# Altium schematic sheet vca_B.SchDoc
size 381 x 241 mm; SheetNumber: 4; SheetTotal: 12
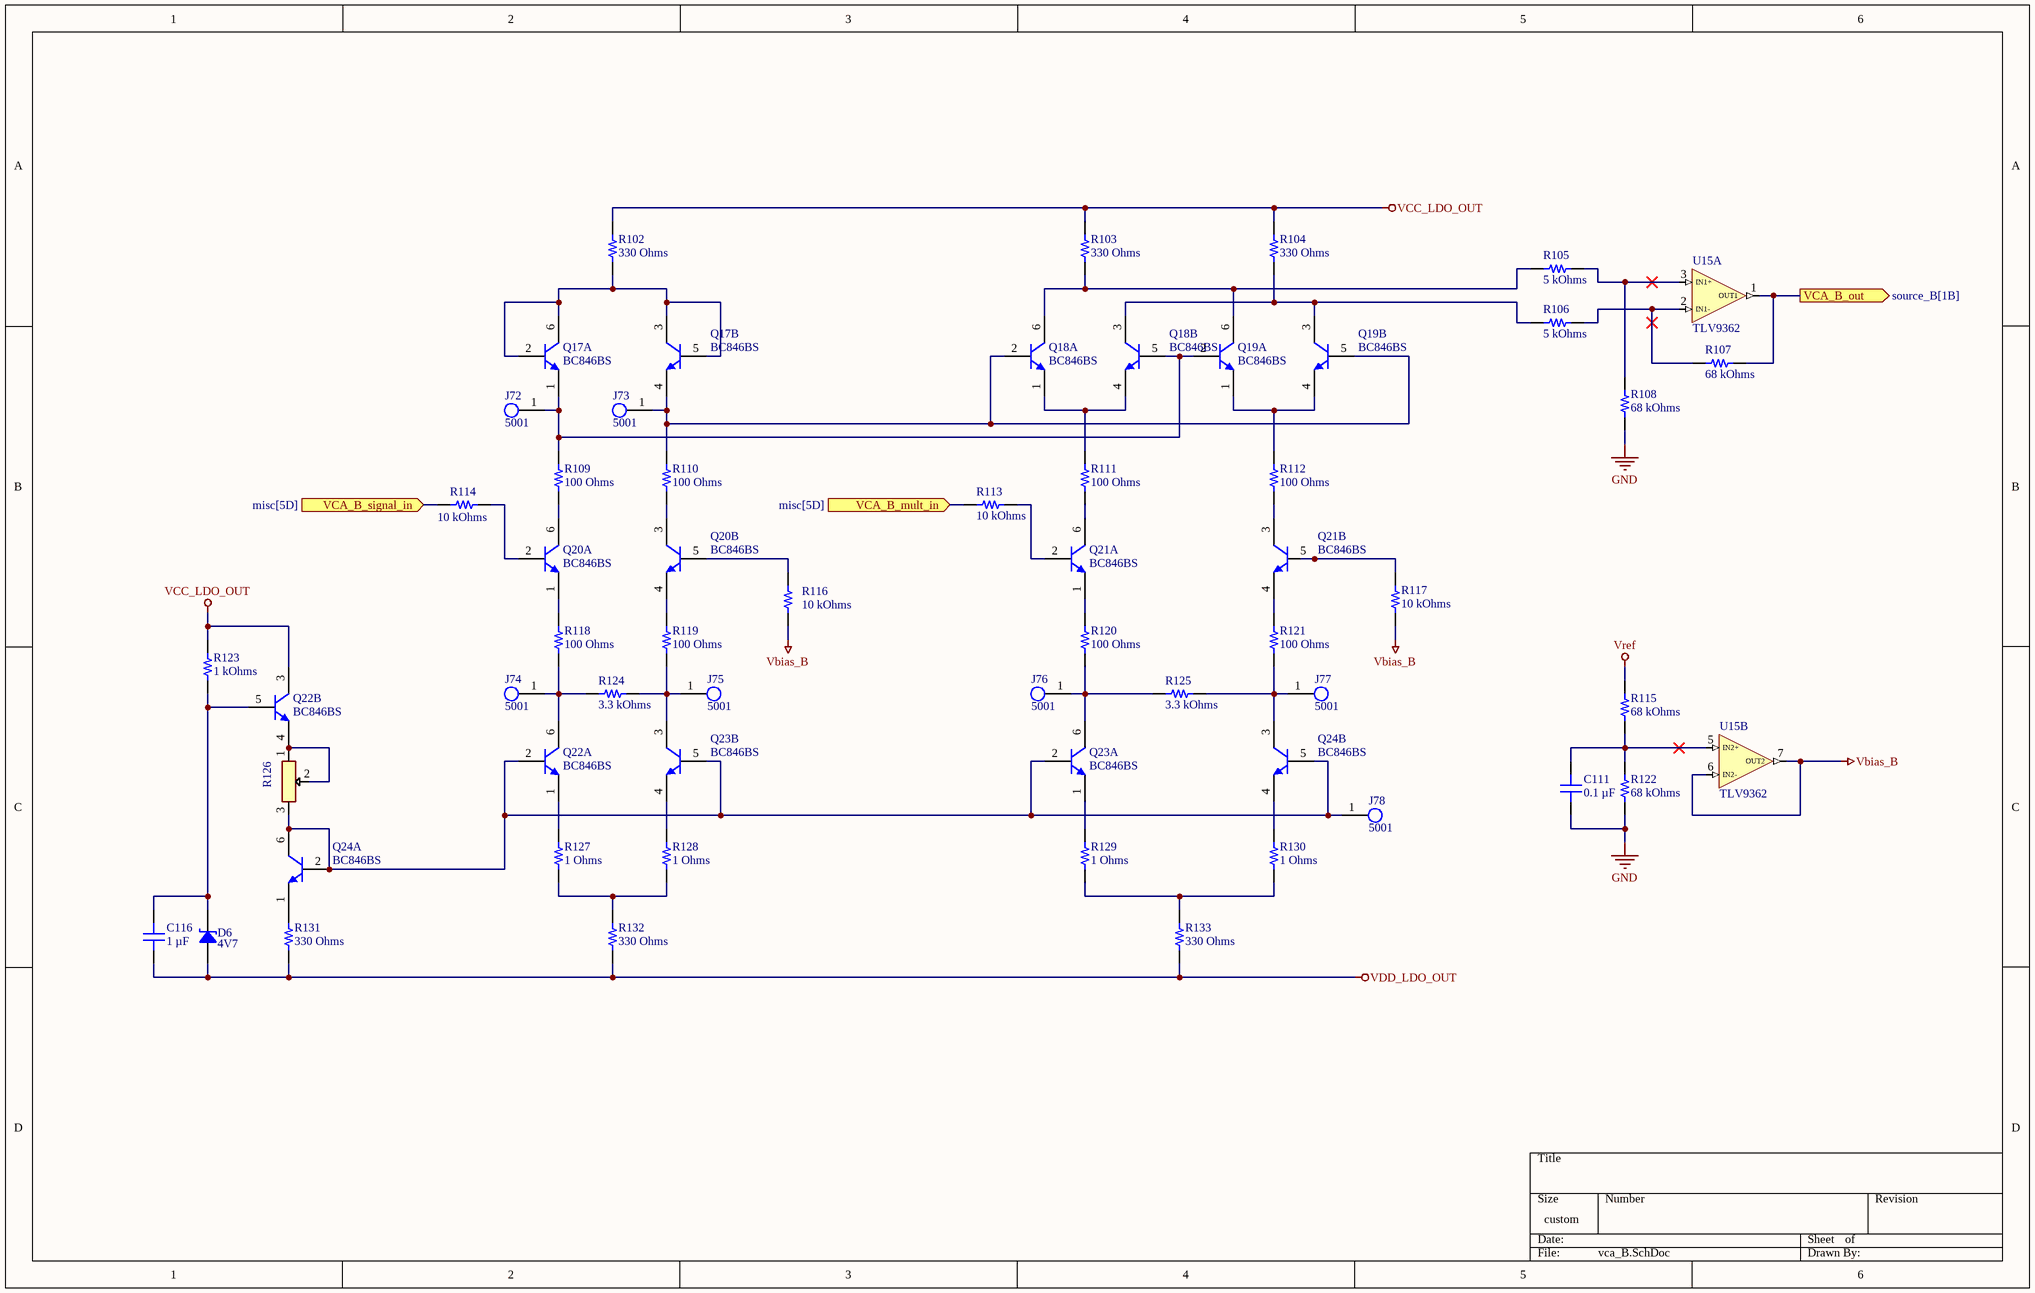
[diagram p0: vca_B.SchDoc]

## Parts
C111  0.1 µF  [CAP 1206_3216 - 0.8MM]
C116  1 µF  [CAP 1206_3216 - 0.8MM]
D6  4V7  [SOD323]
J72  5001  [FP-5001-MFG]
J73  5001  [FP-5001-MFG]
J74  5001  [FP-5001-MFG]
J75  5001  [FP-5001-MFG]
J76  5001  [FP-5001-MFG]
J77  5001  [FP-5001-MFG]
J78  5001  [FP-5001-MFG]
Q17  BC846BS  [TSOP65P210X110-6N]  (parts A,B of 2)
Q18  BC846BS  [TSOP65P210X110-6N]  (parts A,B of 2)
Q19  BC846BS  [TSOP65P210X110-6N]  (parts A,B of 2)
Q20  BC846BS  [TSOP65P210X110-6N]  (parts A,B of 2)
Q21  BC846BS  [TSOP65P210X110-6N]  (parts A,B of 2)
Q22  BC846BS  [TSOP65P210X110-6N]  (parts A,B of 2)
Q23  BC846BS  [TSOP65P210X110-6N]  (parts A,B of 2)
Q24  BC846BS  [TSOP65P210X110-6N]  (parts A,B of 2)
R102  330 Ohms  [YAGEO RES 1206_3216]
R103  330 Ohms  [YAGEO RES 1206_3216]
R104  330 Ohms  [YAGEO RES 1206_3216]
R105  5 kOhms  [YAGEO RES 1206_3216]
R106  5 kOhms  [YAGEO RES 1206_3216]
R107  68 kOhms  [YAGEO RES 1206_3216]
R108  68 kOhms  [YAGEO RES 1206_3216]
R109  100 Ohms  [YAGEO RES 1206_3216]
R110  100 Ohms  [YAGEO RES 1206_3216]
R111  100 Ohms  [YAGEO RES 1206_3216]
R112  100 Ohms  [YAGEO RES 1206_3216]
R113  10 kOhms  [YAGEO RES 1206_3216]
R114  10 kOhms  [YAGEO RES 1206_3216]
R115  68 kOhms  [YAGEO RES 1206_3216]
R116  10 kOhms  [YAGEO RES 1206_3216]
R117  10 kOhms  [YAGEO RES 1206_3216]
R118  100 Ohms  [YAGEO RES 1206_3216]
R119  100 Ohms  [YAGEO RES 1206_3216]
R120  100 Ohms  [YAGEO RES 1206_3216]
R121  100 Ohms  [YAGEO RES 1206_3216]
R122  68 kOhms  [YAGEO RES 1206_3216]
R123  1 kOhms  [YAGEO RES 1206_3216]
R124  3.3 kOhms  [YAGEO RES 1206_3216]
R125  3.3 kOhms  [YAGEO RES 1206_3216]
R126  TC33X-2-502G  [TC33X2503E]  (value not drawn)
R127  1 Ohms  [YAGEO RES 1206_3216]
R128  1 Ohms  [YAGEO RES 1206_3216]
R129  1 Ohms  [YAGEO RES 1206_3216]
R130  1 Ohms  [YAGEO RES 1206_3216]
R131  330 Ohms  [YAGEO RES 1206_3216]
R132  330 Ohms  [YAGEO RES 1206_3216]
R133  330 Ohms  [YAGEO RES 1206_3216]
U15  TLV9362  [SOIC8-127P600X175-8N]  (parts A,B of 3)

## Ports
VCA_B_mult_in (in, see misc[5D]), VCA_B_out (out, see source_B[1B]), VCA_B_signal_in (in, see misc[5D])

## Nets
GND: C111.1 R108.2 R122.1
Vbias_B: R116.1 R117.1 U15.6(IN2-) U15.7(OUT2)
VCC_LDO_OUT: Q22.3(C2) R102.2 R103.2 R104.2 R123.2
VDD_LDO_OUT: C116.1 D6.1 R131.1 R132.1 R133.1
Vref: R115.2
VCA_B_mult_in: R113.1 ; port VCA_B_mult_in
VCA_B_out: R107.1 U15.1(OUT1) ; port VCA_B_out
VCA_B_signal_in: R114.1 ; port VCA_B_signal_in
NetC111_2: C111.2 R115.1 R122.2 U15.5(IN2+)
NetC116_2: C116.2 D6.2 Q22.5(B2) R123.1
NetJ72_1: J72.1 Q17.1(E1) Q18.5(B2) Q19.2(B1) R109.2
NetJ73_1: J73.1 Q17.4(E2) Q18.2(B1) Q19.5(B2) R110.2
NetJ74_1: J74.1 Q22.6(C1) R118.1 R124.2
NetJ75_1: J75.1 Q23.3(C2) R119.1 R124.1
NetJ76_1: J76.1 Q23.6(C1) R120.1 R125.2
NetJ77_1: J77.1 Q24.3(C2) R121.1 R125.1
NetJ78_1: J78.1 Q22.2(B1) Q23.2(B1) Q23.5(B2) Q24.2(B1) Q24.5(B2) Q24.6(C1) R126.3(CW)
NetQ17_2: Q17.2(B1) Q17.3(C2) Q17.5(B2) Q17.6(C1) R102.1
NetQ18_1: Q18.1(E1) Q18.4(E2) R111.2
NetQ18_3: Q18.3(C2) Q19.3(C2) R104.1 R106.2
NetQ18_6: Q18.6(C1) Q19.6(C1) R103.1 R105.2
NetQ19_1: Q19.1(E1) Q19.4(E2) R112.2
NetQ20_1: Q20.1(E1) R118.2
NetQ20_2: Q20.2(B1) R114.2
NetQ20_3: Q20.3(C2) R110.1
NetQ20_4: Q20.4(E2) R119.2
NetQ20_5: Q20.5(B2) R116.2
NetQ20_6: Q20.6(C1) R109.1
NetQ21_1: Q21.1(E1) R120.2
NetQ21_2: Q21.2(B1) R113.2
NetQ21_3: Q21.3(C2) R112.1
NetQ21_4: Q21.4(E2) R121.2
NetQ21_5: Q21.5(B2) R117.2
NetQ21_6: Q21.6(C1) R111.1
NetQ22_1: Q22.1(E1) R127.2
NetQ22_4: Q22.4(E2) R126.1(CCW) R126.2(W)
NetQ23_1: Q23.1(E1) R129.2
NetQ23_4: Q23.4(E2) R128.2
NetQ24_1: Q24.1(E1) R131.2
NetQ24_4: Q24.4(E2) R130.2
NetR105_1: R105.1 R108.1 U15.3(IN1+)
NetR106_1: R106.1 R107.2 U15.2(IN1-)
NetR127_1: R127.1 R128.1 R132.2
NetR129_1: R129.1 R130.1 R133.2

## Library data of the parts
C111 = 885012208087: CAP CER 0.1UF 50V X7R 1206; manufacturer: Würth Elektronik; Tolerance: ±10%; Part Number: 885012208087; Capacitance: 0.1 µF; Applications: General Purpose; componentlink1description: Datasheet; componentlink1url: https://katalog.we-online.de/pbs/datasheet/885012208087.pdf; componentlink2description: DigiKey Link; componentlink2url: https://www.digikey.com/en/products/detail/würth-elektronik/885012208087/5453982; Device Package: 1206 (3216 Metric); lastupdated: 6/4/2024 19:10:27; Lifecycle Status: Active; Minimum Order: 1; Mounting Type: Surface Mount, MLCC; Operating Temperature: -55°C ~ 125°C; Package / Case: 1206 (3216 Metric); packaging: TapeAndReel; partid: 20879; Part Status: Active; price: 0.06; series: WCAP-CSGP; Size / Dimension: 0.126" L x 0.063" W (3.20mm x 1.60mm); Supplier 1: DigiKey; Supplier Part Number 1: 732-8127-1-ND; Temperature Coefficient: X7R; Thickness (Max): 0.035" (0.90mm); value: 0.1 µF; Voltage - Rated: 50V
C116 = 885012208093: CAP CER 1UF 50V X7R 1206; manufacturer: Würth Elektronik; Tolerance: ±10%; Part Number: 885012208093; Capacitance: 1 µF; Applications: General Purpose; componentlink1description: Datasheet; componentlink1url: https://katalog.we-online.de/pbs/datasheet/885012208093.pdf; componentlink2description: DigiKey Link; componentlink2url: https://www.digikey.com/en/products/detail/würth-elektronik/885012208093/5453432; Device Package: 1206 (3216 Metric); lastupdated: 6/4/2024 19:10:33; Lifecycle Status: Active; Minimum Order: 1; Mounting Type: Surface Mount, MLCC; Operating Temperature: -55°C ~ 125°C; Package / Case: 1206 (3216 Metric); packaging: TapeAndReel; partid: 39665; Part Status: Active; price: 0.10; series: WCAP-CSGP; Size / Dimension: 0.126" L x 0.063" W (3.20mm x 1.60mm); Supplier 1: DigiKey; Supplier Part Number 1: 732-7577-1-ND; Temperature Coefficient: X7R; Thickness (Max): 0.075" (1.90mm); value: 1 µF; Voltage - Rated: 50V
D6 = BZX38450-C4V7X
J72-J78 = CMP-2000-05181-2: PC TEST POINT MINIATURE BLACK; Body Material: Bronze; Plating: Silver; Inside Diameter: 1.27mm; Hole Diameter: 1.6mm; Number of Ports: 1; Outside Diameter: 2.54mm; Insulation: Insulated; Insulation Material: Nylon; Mount: Through Hole; RoHS Compliant: Yes; Series: THM; Height: 0.3inch; Termination: Through Hole; Material: Nylon; Packaging: Bulk; Contact Material: Bronze; REACH SVHC: No SVHC; Contact Plating: Silver; Orientation: Straight; Lead Free: Lead Free; Package Quantity: 100; Length: 7.62mm; Flammability Rating: UL94 V-0; Number of Contacts: 1; Diameter: 2.54mm; Housing Color: Black; Color: Black
Q17-Q24 = BC846BS: 65 V, 100 mA matched NPN/NPN general-purpose transistor; ComponentLink1Description: Datasheet; ComponentLink1URL: https://assets.nexperia.com/documents/data-sheet/BC846BS.pdf
R102-R104 R131-R133 = RT1206FRD07330RL: RES SMD 330 OHM 1% 1/4W 1206; Manufacturer: Yageo; Power (Watts): 0.25W, 1/4W; Temperature Coefficient: ±25ppm/°C; Part Number: RT1206FRD07330RL; ComponentLink1Description: Datasheet; ComponentLink1URL: https://www.yageo.com/upload/media/product/productsearch/datasheet/rchip/PYu-RT_1-to-0.01_RoHS_L_15.pdf; ComponentLink2Description: DigiKey Link; ComponentLink2URL: https://www.digikey.com/en/products/detail/yageo/RT1206FRD07330RL/5938576; Composition: Thin Film; Device Package: 1206 (3216 Metric); Height - Seated (Max): 0.026" (0.65mm); LastUpdated: 7/25/2024 09:21:16; Lifecycle Status: Active; Minimum Order: 1; Number of Terminations: 2; Operating Temperature: -55°C ~ 155°C; Package / Case: 1206 (3216 Metric); Packaging: TapeAndReel; PartId: 79140; Price: 0.01; Resistance: 330 Ohms; Series: RT; Size / Dimension: 0.122" L x 0.063" W (3.10mm x 1.60mm); Supplier 1: DigiKey; Supplier Part Number 1: 13-RT1206FRD07330RLCT-ND; Supplier Device Package: 1206; Tolerance: ±1%; Value: 330 Ohms
R105 R106 = RT1206FRE075KL: RES 5K OHM 1% 1/4W 1206; Manufacturer: Yageo; Power (Watts): 0.25W, 1/4W; Temperature Coefficient: ±50ppm/°C; Part Number: RT1206FRE075KL; ComponentLink1Description: Datasheet; ComponentLink1URL: https://www.yageo.com/upload/media/product/app/datasheet/rchip/pyu-rt_1-to-0.01_rohs_l.pdf; ComponentLink2Description: DigiKey Link; ComponentLink2URL: https://www.digikey.com/en/products/detail/yageo/RT1206FRE075KL/7708705; Composition: Thin Film; Device Package: 1206 (3216 Metric); Height - Seated (Max): 0.026" (0.65mm); LastUpdated: 7/25/2024 09:21:03; Lifecycle Status: Active; Minimum Order: 1; Number of Terminations: 2; Operating Temperature: -55°C ~ 155°C; Package / Case: 1206 (3216 Metric); Packaging: TapeAndReel; PartId: 88354; Price: 0.01; Resistance: 5 kOhms; Series: RT; Size / Dimension: 0.122" L x 0.063" W (3.10mm x 1.60mm); Supplier 1: DigiKey; Supplier Part Number 1: 13-RT1206FRE075KLCT-ND; Supplier Device Package: 1206; Tolerance: ±1%; Value: 5 kOhms
R107 R108 R115 R122 = RT1206FRE0768KL: RES SMD 68K OHM 1% 1/4W 1206; Manufacturer: Yageo; Power (Watts): 0.25W, 1/4W; Temperature Coefficient: ±50ppm/°C; Part Number: RT1206FRE0768KL; ComponentLink1Description: Datasheet; ComponentLink1URL: https://www.yageo.com/upload/media/product/productsearch/datasheet/rchip/PYu-RT_1-to-0.01_RoHS_L_12.pdf; ComponentLink2Description: DigiKey Link; ComponentLink2URL: https://www.digikey.com/en/products/detail/yageo/RT1206FRE0768KL/1083332; Composition: Thin Film; Device Package: 1206 (3216 Metric); Height - Seated (Max): 0.026" (0.65mm); LastUpdated: 7/25/2024 09:21:23; Lifecycle Status: Active; Minimum Order: 1; Number of Terminations: 2; Operating Temperature: -55°C ~ 155°C; Package / Case: 1206 (3216 Metric); Packaging: TapeAndReel; PartId: 58462; Part Status: Active; Price: 0.01; Resistance: 68 kOhms; Series: RT; Size / Dimension: 0.122" L x 0.063" W (3.10mm x 1.60mm); Supplier 1: DigiKey; Supplier Part Number 1: 13-RT1206FRE0768KLCT-ND; Supplier Device Package: 1206; Tolerance: ±1%; Value: 68 kOhms
R109-R112 R118-R121 = RT1206FRD07100RL: RES SMD 100 OHM 1% 1/4W 1206; Manufacturer: Yageo; Power (Watts): 0.25W, 1/4W; Temperature Coefficient: ±25ppm/°C; Part Number: RT1206FRD07100RL; ComponentLink1Description: Datasheet; ComponentLink1URL: https://www.yageo.com/upload/media/product/productsearch/datasheet/rchip/PYu-RT_1-to-0.01_RoHS_L_12.pdf; ComponentLink2Description: DigiKey Link; ComponentLink2URL: https://www.digikey.com/en/products/detail/yageo/RT1206FRD07100RL/5938292; Composition: Thin Film; Device Package: 1206 (3216 Metric); Height - Seated (Max): 0.026" (0.65mm); LastUpdated: 7/25/2024 09:21:23; Lifecycle Status: Active; Minimum Order: 1; Number of Terminations: 2; Operating Temperature: -55°C ~ 155°C; Package / Case: 1206 (3216 Metric); Packaging: TapeAndReel; PartId: 58461; Part Status: Active; Price: 0.01; Resistance: 100 Ohms; Series: RT; Size / Dimension: 0.122" L x 0.063" W (3.10mm x 1.60mm); Supplier 1: DigiKey; Supplier Part Number 1: 13-RT1206FRD07100RLCT-ND; Supplier Device Package: 1206; Tolerance: ±1%; Value: 100 Ohms
R113 R114 R116 R117 = RT1206FRE0710KL: RES SMD 10K OHM 1% 1/4W 1206; Manufacturer: Yageo; Power (Watts): 0.25W, 1/4W; Temperature Coefficient: ±50ppm/°C; Part Number: RT1206FRE0710KL; ComponentLink1Description: Datasheet; ComponentLink1URL: https://www.yageo.com/upload/media/product/productsearch/datasheet/rchip/PYu-RT_1-to-0.01_RoHS_L_11.pdf; ComponentLink2Description: DigiKey Link; ComponentLink2URL: https://www.digikey.com/en/products/detail/yageo/RT1206FRE0710KL/1082868; Composition: Thin Film; Device Package: 1206 (3216 Metric); Height - Seated (Max): 0.026" (0.65mm); LastUpdated: 7/25/2024 09:21:28; Lifecycle Status: Active; Minimum Order: 1; Number of Terminations: 2; Operating Temperature: -55°C ~ 155°C; Package / Case: 1206 (3216 Metric); Packaging: TapeAndReel; PartId: 38903; Part Status: Active; Price: 0.01; Resistance: 10 kOhms; Series: RT; Size / Dimension: 0.122" L x 0.063" W (3.10mm x 1.60mm); Supplier 1: DigiKey; Supplier Part Number 1: YAG1242CT-ND; Supplier Device Package: 1206; Tolerance: ±1%; Value: 10 kOhms
R123 = RT1206FRE071KL: RES SMD 1K OHM 1% 1/4W 1206; Manufacturer: Yageo; Power (Watts): 0.25W, 1/4W; Temperature Coefficient: ±50ppm/°C; Part Number: RT1206FRE071KL; ComponentLink1Description: Datasheet; ComponentLink1URL: https://www.yageo.com/upload/media/product/productsearch/datasheet/rchip/PYu-RT_1-to-0.01_RoHS_L_11.pdf; ComponentLink2Description: DigiKey Link; ComponentLink2URL: https://www.digikey.com/en/products/detail/yageo/RT1206FRE071KL/1083016; Composition: Thin Film; Device Package: 1206 (3216 Metric); Height - Seated (Max): 0.026" (0.65mm); LastUpdated: 7/25/2024 09:21:27; Lifecycle Status: Active; Minimum Order: 1; Number of Terminations: 2; Operating Temperature: -55°C ~ 155°C; Package / Case: 1206 (3216 Metric); Packaging: TapeAndReel; PartId: 40465; Part Status: Active; Price: 0.01; Resistance: 1 kOhms; Series: RT; Size / Dimension: 0.122" L x 0.063" W (3.10mm x 1.60mm); Supplier 1: DigiKey; Supplier Part Number 1: YAG3366CT-ND; Supplier Device Package: 1206; Tolerance: ±1%; Value: 1 kOhms
R124 R125 = RT1206FRE073K3L: RES SMD 3.3K OHM 1% 1/4W 1206; Manufacturer: Yageo; Power (Watts): 0.25W, 1/4W; Temperature Coefficient: ±50ppm/°C; Part Number: RT1206FRE073K3L; ComponentLink1Description: Datasheet; ComponentLink1URL: https://www.yageo.com/upload/media/product/productsearch/datasheet/rchip/PYu-RT_1-to-0.01_RoHS_L_12.pdf; ComponentLink2Description: DigiKey Link; ComponentLink2URL: https://www.digikey.com/en/products/detail/yageo/RT1206FRE073K3L/1083187; Composition: Thin Film; Device Package: 1206 (3216 Metric); Height - Seated (Max): 0.026" (0.65mm); LastUpdated: 7/25/2024 09:21:22; Lifecycle Status: Active; Minimum Order: 1; Number of Terminations: 2; Operating Temperature: -55°C ~ 155°C; Package / Case: 1206 (3216 Metric); Packaging: TapeAndReel; PartId: 58380; Price: 0.01; Resistance: 3.3 kOhms; Series: RT; Size / Dimension: 0.122" L x 0.063" W (3.10mm x 1.60mm); Supplier 1: DigiKey; Supplier Part Number 1: 13-RT1206FRE073K3LCT-ND; Supplier Device Package: 1206; Tolerance: ±1%; Value: 3.3 kOhms; Part Status: Active
R126 = TC33X-2-502G: Resistor; Manufacturer_Name: Bourns; Datasheet Link: https://componentsearchengine.com/Datasheets/1/TC33X-2-502G.pdf; Height: 1.2mm; Manufacturer_Part_Number: TC33X-2-502G; Mouser Part Number: 652-TC33X-2-502G; Mouser Price/Stock: https://www.mouser.co.uk/ProductDetail/Bourns/TC33X-2-502G?qs=UmpSLsh52mVfPYqLYJpjzQ%3D%3D; Arrow Part Number: TC33X-2-502G; Arrow Price/Stock: https://www.arrow.com/en/products/tc33x-2-502g/bourns?region=nac
R127-R130 = RT1206BRD071RL: RES 1 OHM 0.1% 1/4W 1206; Manufacturer: Yageo; Power (Watts): 0.25W, 1/4W; Temperature Coefficient: ±25ppm/°C; Part Number: RT1206BRD071RL; ComponentLink1Description: Datasheet; ComponentLink1URL: https://www.yageo.com/upload/media/product/productsearch/datasheet/rchip/PYu-RT_1-to-0.01_RoHS_L_15.pdf; ComponentLink2Description: DigiKey Link; ComponentLink2URL: https://www.digikey.com/en/products/detail/yageo/RT1206BRD071RL/17018181; Composition: Thin Film; Device Package: 1206 (3216 Metric); Features: Moisture Resistant; Height - Seated (Max): 0.026" (0.65mm); LastUpdated: 7/25/2024 09:21:16; Lifecycle Status: Active; Minimum Order: 1; Number of Terminations: 2; Operating Temperature: -55°C ~ 155°C; Package / Case: 1206 (3216 Metric); Packaging: TapeAndReel; PartId: 79150; Price: 0.14; Resistance: 1 Ohms; Series: RT; Size / Dimension: 0.122" L x 0.063" W (3.10mm x 1.60mm); Supplier 1: DigiKey; Supplier Part Number 1: 13-RT1206BRD071RLCT-ND; Supplier Device Package: 1206; Tolerance: ±0.1%; Value: 1 Ohms
U15 = TLV9362: TLV936x 10-MHz, 40-V, RRO, Operational Amplifie; ComponentLink1Description: Datasheet; ComponentLink1URL: https://www.ti.com/lit/ds/symlink/tlv9362.pdf